# Altium schematic sheet Remote_sensor.SCHDOC
size A3; SheetNumber: 0; SheetTotal: 0
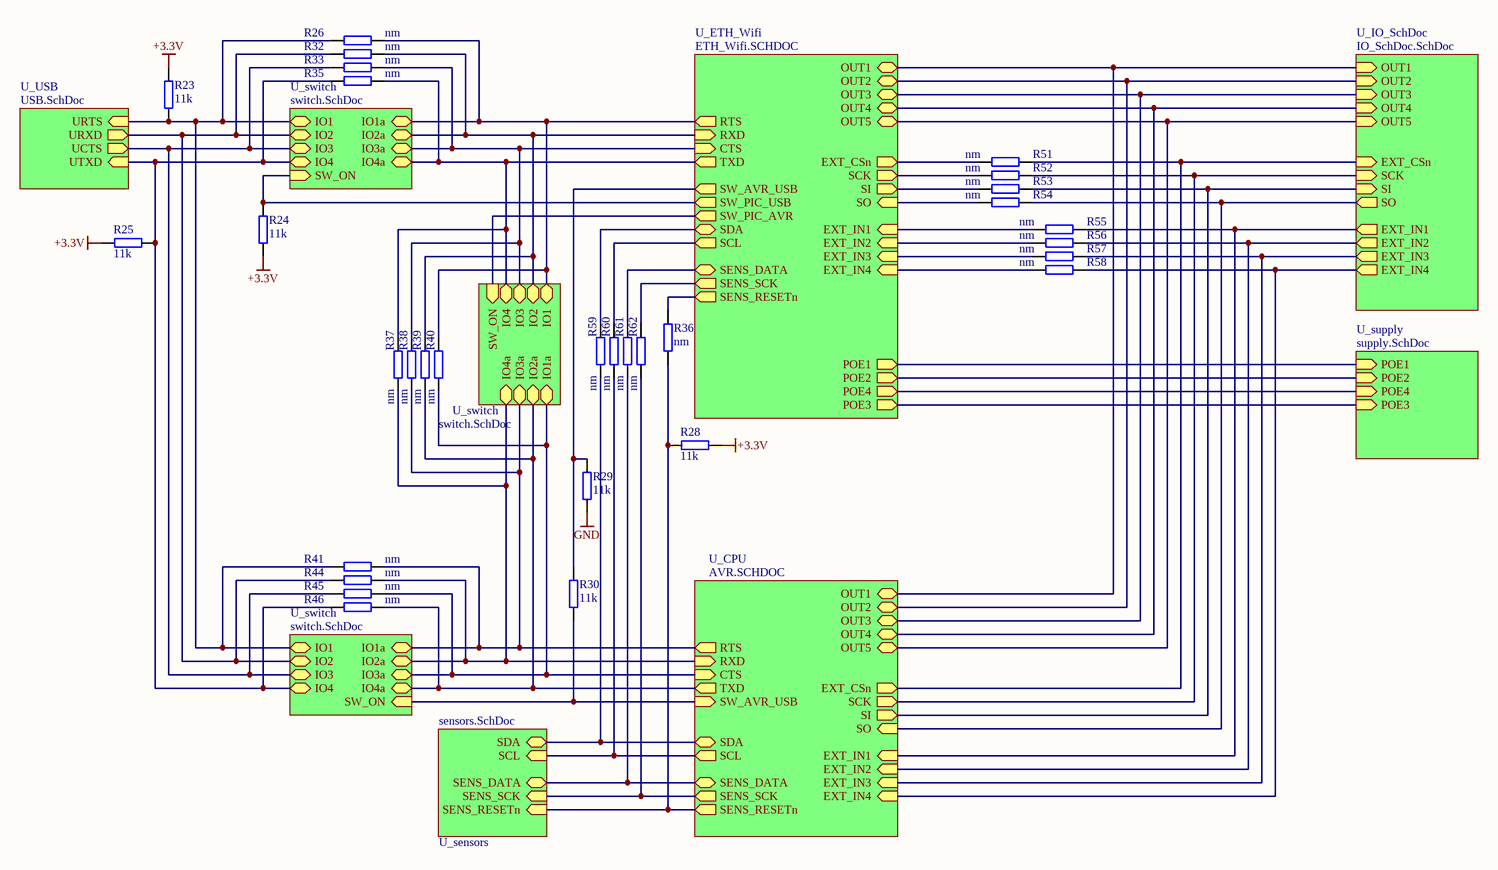
[diagram p0: Remote_sensor.SCHDOC]

## Parts
R23  11k  [0603]
R24  11k  [0603]
R25  11k  [0603]
R26  nm  [0603]
R28  11k  [0603]
R29  11k  [0603]
R30  11k  [0603]
R32  nm  [0603]
R33  nm  [0603]
R35  nm  [0603]
R36  nm  [0603]
R37  nm  [0603]
R38  nm  [0603]
R39  nm  [0603]
R40  nm  [0603]
R41  nm  [0603]
R44  nm  [0603]
R45  nm  [0603]
R46  nm  [0603]
R51  nm  [0603]
R52  nm  [0603]
R53  nm  [0603]
R54  nm  [0603]
R55  nm  [0603]
R56  nm  [0603]
R57  nm  [0603]
R58  nm  [0603]
R59  nm  [0603]
R60  nm  [0603]
R61  nm  [0603]
R62  nm  [0603]

## Sub-sheets
U_CPU = AVR.SCHDOC: OUT1 (bidir), OUT2 (bidir), OUT3 (bidir), OUT4 (bidir), OUT5 (bidir), CTS (in), RTS (out), TXD (out), RXD (in), EXT_CSn (out), SI (out), SO (in), SCK (out), EXT_IN4 (in), EXT_IN3 (in), EXT_IN2 (in), EXT_IN1 (in), SDA (bidir), SCL (out), SENS_RESETn (out), SENS_DATA (bidir), SENS_SCK (out), SW_AVR_USB (in)
U_ETH_Wifi = ETH_Wifi.SCHDOC: OUT1 (bidir), OUT2 (bidir), OUT3 (bidir), OUT4 (bidir), OUT5 (bidir), CTS (in), RTS (out), TXD (out), RXD (in), EXT_CSn (out), SI (out), SO (in), SCK (out), EXT_IN4 (in), EXT_IN3 (in), EXT_IN2 (in), EXT_IN1 (in), SDA (bidir), SCL (out), SENS_RESETn (out), SENS_DATA (bidir), SENS_SCK (out), SW_PIC_USB (out), SW_PIC_AVR (out), SW_AVR_USB (out), POE1 (out), POE2 (out), POE4 (out), POE3 (out)
U_IO_SchDoc = IO_SchDoc.SchDoc: OUT1 (in), OUT2 (in), OUT3 (in), OUT4 (in), OUT5 (in), SI (in), SCK (in), SO (out), EXT_CSn (in), EXT_IN1 (out), EXT_IN2 (out), EXT_IN3 (out), EXT_IN4 (out)
U_sensors = sensors.SchDoc: SDA (bidir), SCL (in), SENS_RESETn (in), SENS_DATA (bidir), SENS_SCK (in)
U_supply = supply.SchDoc: POE1 (in), POE2 (in), POE4 (in), POE3 (in)
U_switch = switch.SchDoc: IO1 (bidir), IO2 (bidir), IO3 (bidir), IO4 (bidir), IO1a (bidir), IO2a (bidir), IO3a (bidir), IO4a (bidir), SW_ON (in)
U_switch = switch.SchDoc: IO1 (bidir), IO2 (bidir), IO3 (bidir), IO4 (bidir), IO1a (bidir), IO2a (bidir), IO3a (bidir), IO4a (bidir), SW_ON (in)
U_switch = switch.SchDoc: IO1 (bidir), IO2 (bidir), IO3 (bidir), IO4 (bidir), IO1a (bidir), IO2a (bidir), IO3a (bidir), IO4a (bidir), SW_ON (in)
U_USB = USB.SchDoc: UTXD (in), URXD (out), UCTS (out), URTS (in)

## Nets
+3.3V: R23.2 R24.1 R25.2 R28.1
GND: R29.1
NetR23_1: R23.1 R26.2 R41.2 ; sheet U_USB/URTS, sheet U_switch/IO1, sheet U_switch/IO1
NetR24_2: R24.2 ; sheet U_ETH_Wifi/SW_PIC_USB, sheet U_switch/SW_ON
NetR25_1: R25.1 R35.2 R46.2 ; sheet U_USB/UTXD, sheet U_switch/IO4, sheet U_switch/IO4
NetR26_1: R26.1 R40.1 ; sheet U_ETH_Wifi/RTS, sheet U_switch/IO1a, sheet U_switch/IO1
NetR28_2: R28.2 R36.1 ; sheet U_sensors/SENS_RESETn, sheet U_CPU/SENS_RESETn
NetR29_2: R29.2 R30.2 ; sheet U_ETH_Wifi/SW_AVR_USB
NetR30_1: R30.1 ; sheet U_CPU/SW_AVR_USB, sheet U_switch/SW_ON
NetR32_1: R32.1 R39.1 ; sheet U_ETH_Wifi/RXD, sheet U_switch/IO2a, sheet U_switch/IO2
NetR32_2: R32.2 R44.2 ; sheet U_USB/URXD, sheet U_switch/IO2, sheet U_switch/IO2
NetR33_1: R33.1 R38.1 ; sheet U_ETH_Wifi/CTS, sheet U_switch/IO3a, sheet U_switch/IO3
NetR33_2: R33.2 R45.2 ; sheet U_USB/UCTS, sheet U_switch/IO3, sheet U_switch/IO3
NetR35_1: R35.1 R37.1 ; sheet U_ETH_Wifi/TXD, sheet U_switch/IO4a, sheet U_switch/IO4
NetR36_2: R36.2 ; sheet U_ETH_Wifi/SENS_RESETn
NetR37_2: R37.2 R44.1 ; sheet U_CPU/RXD, sheet U_switch/IO2a, sheet U_switch/IO4a
NetR38_2: R38.2 R41.1 ; sheet U_CPU/RTS, sheet U_switch/IO1a, sheet U_switch/IO3a
NetR39_2: R39.2 R46.1 ; sheet U_CPU/TXD, sheet U_switch/IO4a, sheet U_switch/IO2a
NetR40_2: R40.2 R45.1 ; sheet U_CPU/CTS, sheet U_switch/IO3a, sheet U_switch/IO1a
NetR51_1: R51.1 ; sheet U_IO_SchDoc/EXT_CSn, sheet U_CPU/EXT_CSn
NetR51_2: R51.2 ; sheet U_ETH_Wifi/EXT_CSn
NetR52_1: R52.1 ; sheet U_IO_SchDoc/SCK, sheet U_CPU/SCK
NetR52_2: R52.2 ; sheet U_ETH_Wifi/SCK
NetR53_1: R53.1 ; sheet U_IO_SchDoc/SI, sheet U_CPU/SI
NetR53_2: R53.2 ; sheet U_ETH_Wifi/SI
NetR54_1: R54.1 ; sheet U_IO_SchDoc/SO, sheet U_CPU/SO
NetR54_2: R54.2 ; sheet U_ETH_Wifi/SO
NetR55_1: R55.1 ; sheet U_IO_SchDoc/EXT_IN1, sheet U_CPU/EXT_IN1
NetR55_2: R55.2 ; sheet U_ETH_Wifi/EXT_IN1
NetR56_1: R56.1 ; sheet U_IO_SchDoc/EXT_IN2, sheet U_CPU/EXT_IN2
NetR56_2: R56.2 ; sheet U_ETH_Wifi/EXT_IN2
NetR57_1: R57.1 ; sheet U_IO_SchDoc/EXT_IN3, sheet U_CPU/EXT_IN3
NetR57_2: R57.2 ; sheet U_ETH_Wifi/EXT_IN3
NetR58_1: R58.1 ; sheet U_IO_SchDoc/EXT_IN4, sheet U_CPU/EXT_IN4
NetR58_2: R58.2 ; sheet U_ETH_Wifi/EXT_IN4
NetR59_1: R59.1 ; sheet U_ETH_Wifi/SDA
NetR59_2: R59.2 ; sheet U_sensors/SDA, sheet U_CPU/SDA
NetR60_1: R60.1 ; sheet U_ETH_Wifi/SCL
NetR60_2: R60.2 ; sheet U_sensors/SCL, sheet U_CPU/SCL
NetR61_1: R61.1 ; sheet U_ETH_Wifi/SENS_DATA
NetR61_2: R61.2 ; sheet U_sensors/SENS_DATA, sheet U_CPU/SENS_DATA
NetR62_1: R62.1 ; sheet U_ETH_Wifi/SENS_SCK
NetR62_2: R62.2 ; sheet U_sensors/SENS_SCK, sheet U_CPU/SENS_SCK
(unnamed): sheet U_ETH_Wifi/OUT1, sheet U_IO_SchDoc/OUT1, sheet U_CPU/OUT1
(unnamed): sheet U_ETH_Wifi/OUT2, sheet U_IO_SchDoc/OUT2, sheet U_CPU/OUT2
(unnamed): sheet U_ETH_Wifi/OUT3, sheet U_IO_SchDoc/OUT3, sheet U_CPU/OUT3
(unnamed): sheet U_ETH_Wifi/OUT4, sheet U_IO_SchDoc/OUT4, sheet U_CPU/OUT4
(unnamed): sheet U_ETH_Wifi/OUT5, sheet U_IO_SchDoc/OUT5, sheet U_CPU/OUT5
(unnamed): sheet U_ETH_Wifi/SW_PIC_AVR, sheet U_switch/SW_ON
(unnamed): sheet U_ETH_Wifi/POE1, sheet U_supply/POE1
(unnamed): sheet U_ETH_Wifi/POE2, sheet U_supply/POE2
(unnamed): sheet U_ETH_Wifi/POE4, sheet U_supply/POE4
(unnamed): sheet U_ETH_Wifi/POE3, sheet U_supply/POE3

## Library data of the parts
R23-R26 R28-R30 R32 R33 R35-R41 R44-R46 R51-R62 = RES_SMD: SMD Resistor